# Altium schematic sheet MAIN-SCH.SchDoc
size A; SheetNumber: 1; SheetTotal: 2
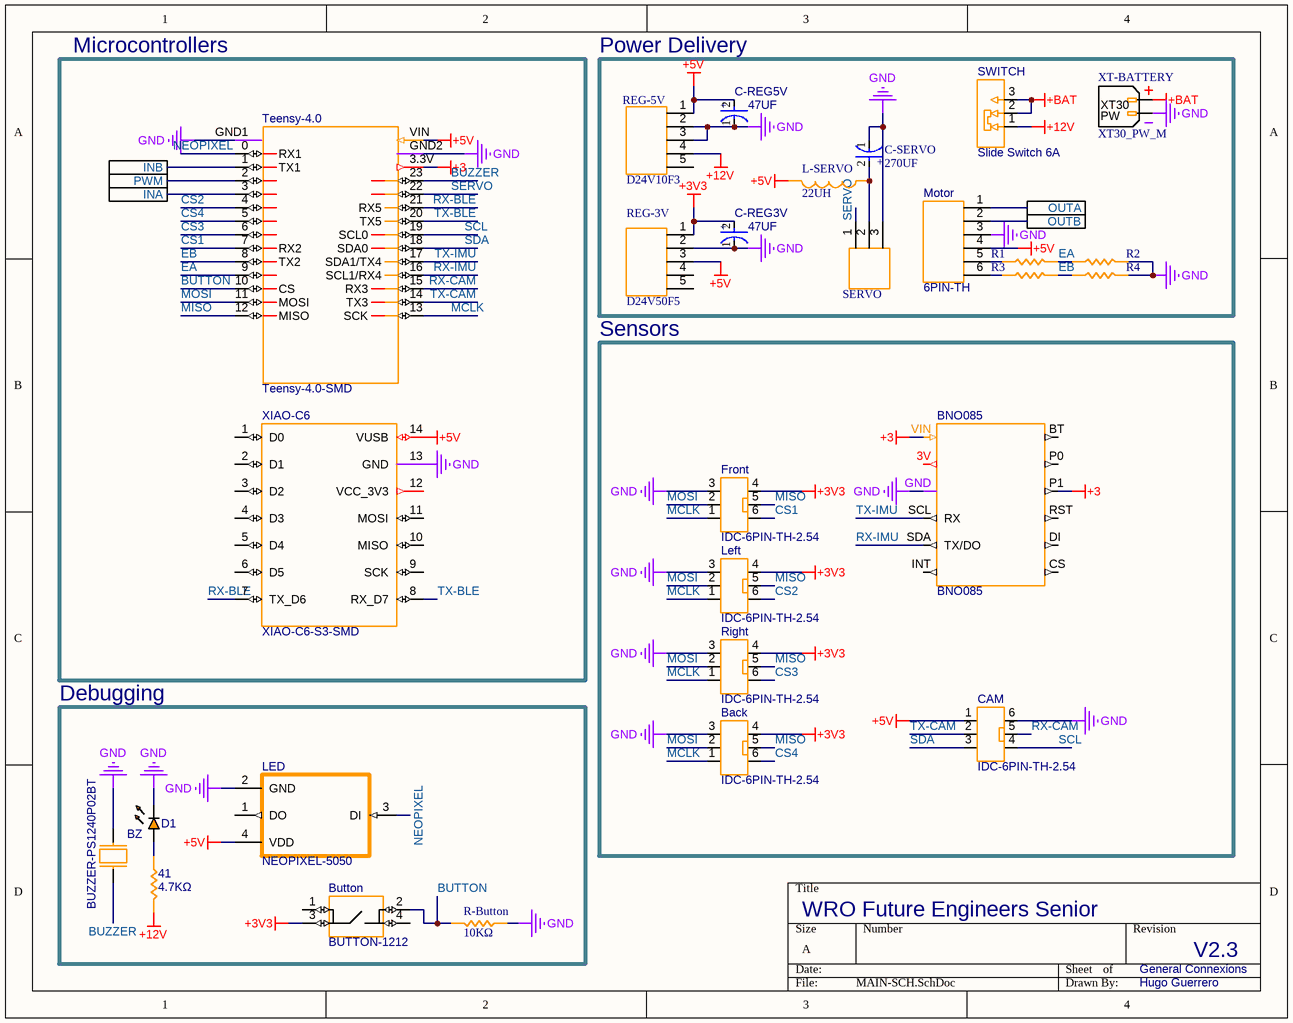
[diagram p0: MAIN-SCH.SchDoc]

## Parts
41  4.7KΩ  [RES_0603]
Back  IDC-6PIN-TH-2.54  [IDC-6PIN-TH-2.54]
BNO085  BNO085  [BNO085]
Button  BUTTON-1212  [BUTTON]
BZ  BUZZER-PS1240P02BT  [BUZZER]
C-REG3V  47UF  [FP-FTD8-MFG]
C-REG5V  47UF  [FP-FTD8-MFG]
C-SERVO  270UF  [FP-FTD8-MFG]
CAM  IDC-6PIN-TH-2.54  [IDC-6PIN-TH-2.54]
D1  LED_0603  [LED_0603]  (value not drawn)
D24V10F3  REG-5V  [5PIN-TH]
D24V50F5  REG-3V  [5PIN-TH]
Front  IDC-6PIN-TH-2.54  [IDC-6PIN-TH-2.54]
L-SERVO  22UH  [WRO-INDUCTOR]
LED  NEOPIXEL-5050  [NEOPIXEL-5050]
Left  IDC-6PIN-TH-2.54  [IDC-6PIN-TH-2.54]
Motor  6PIN-TH  [6PIN-TH]
R1  10KΩ  [RES_0603]  (value not drawn)
R2  10KΩ  [RES_0603]  (value not drawn)
R3  10KΩ  [RES_0603]  (value not drawn)
R4  10KΩ  [RES_0603]  (value not drawn)
R-Button  10KΩ  [RES_0603]
Right  IDC-6PIN-TH-2.54  [IDC-6PIN-TH-2.54]
SERVO  3PIN  [3PIN]  (value not drawn)
SWITCH  Slide Switch 6A  [Slide Switch 6A]
Teensy-4.0  Teensy-4.0-SMD  [Teensy-4.0-SMD]
XIAO-C6  XIAO-C6-S3-SMD  [XIAO-C6-S3-SMD]
XT-BATTERY  XT30_PW_M  [XT30_PW_M]

## Blocks framed on the sheet
Microcontrollers: Teensy-4.0 XIAO-C6
Power Delivery: C-REG3V C-REG5V C-SERVO D24V10F3 D24V50F5 L-SERVO Motor R1-R4 SERVO SWITCH XT-BATTERY
Sensors: Back BNO085 CAM Front Left Right
Debugging: 41 Button BZ D1 LED R-Button

## Ports
INA (see VNH7070-P[1C]), INB (see VNH7070-P[1C]), OUTA (see VNH7070-P[3C]), OUTB (see VNH7070-P[3C]), PWM (see VNH7070-P[1C])

## Nets
+3: BNO085.P1 BNO085.VIN Teensy-4.0.3.3V(3.3V-2)
+3V3: Back.4 Button.3 C-REG3V.2(A) D24V50F5.1 Front.4 Left.4 Right.4
+5V: C-REG5V.2(A) CAM.1 D24V10F3.1 D24V50F5.3 L-SERVO.2 LED.4(VDD) Motor.4 Teensy-4.0.VIN XIAO-C6.14(VUSB)
+12V: 41.1 D24V10F3.4 SWITCH.1(NC)
+BAT: SWITCH.2(COM) SWITCH.3(NO) XT-BATTERY.P
GND: Back.3 BNO085.GND BZ.2 C-REG3V.1(C) C-REG5V.1(C) C-SERVO.1(C) CAM.6 D1.C D24V10F3.2 D24V10F3.3 D24V50F5.2 Front.3 LED.2(GND) Left.3 Motor.3 R2.1 R4.1 R-Button.2 Right.3 SERVO.3 Teensy-4.0.GND1 Teensy-4.0.GND2(GND3) XIAO-C6.13(GND) XT-BATTERY.N
BUTTON: Button.2 R-Button.1 Teensy-4.0.10(CS)
BUZZER: BZ.1 Teensy-4.0.23
CS1: Front.6 Teensy-4.0.7(RX2)
CS2: Left.6 Teensy-4.0.4
CS3: Right.6 Teensy-4.0.6
CS4: Back.6 Teensy-4.0.5
EA: R1.1 R2.2 Teensy-4.0.9
EB: R3.1 R4.2 Teensy-4.0.8(TX2)
INA: Teensy-4.0.3 ; port INA
INB: Teensy-4.0.1(TX1) ; port INB
MCLK: Back.1 Front.1 Left.1 Right.1 Teensy-4.0.13(SCK)
MISO: Back.5 Front.5 Left.5 Right.5 Teensy-4.0.12(MISO)
MOSI: Back.2 Front.2 Left.2 Right.2 Teensy-4.0.11(MOSI)
NEOPIXEL: LED.3(DI) Teensy-4.0.0(RX1)
OUTA: Motor.1 ; port OUTA
OUTB: Motor.2 ; port OUTB
PWM: Teensy-4.0.2 ; port PWM
RX-BLE: Teensy-4.0.21(RX5) XIAO-C6.7(TX_D6)
RX-CAM: CAM.5 Teensy-4.0.15(RX3)
RX-IMU: BNO085.SDA(TX/DO) Teensy-4.0.16(SCL1/RX4)
SCL: CAM.4 Teensy-4.0.19(SCL0)
SDA: CAM.3 Teensy-4.0.18(SDA0)
SERVO: SERVO.1 Teensy-4.0.22
TX-BLE: Teensy-4.0.20(TX5) XIAO-C6.8(RX_D7)
TX-CAM: CAM.2 Teensy-4.0.14(TX3)
TX-IMU: BNO085.SCL(RX) Teensy-4.0.17(SDA1/TX4)
Net41_2: 41.2 D1.A
NetC-SERVO_2: C-SERVO.2(A) L-SERVO.1 SERVO.2
NetMotor_5: Motor.5 R1.2
NetMotor_6: Motor.6 R3.2

Not connected (* = marked no-connect by the designer): BNO085 3V BT CS DI INT P0 RST; Button 1 4; D24V10F3 5(05); D24V50F5 4(04) 5(05); LED 1(DO); XIAO-C6 1(D0) 2(D1) 3(D2) 4(D3) 5(D4) 6(D5) 9(SCK) 10(MISO) 11(MOSI) 12(VCC_3V3)

## Notes on the sheet
- WRO Future Engineers Senior
- General Connexions
- V2.3
- Hugo Guerrero
- (in symbol CMP-05427-000088-1) +
- (in symbol XT30_PW_M) XT30; PW

## Library data of the parts
41 R1-R4 R-Button = RES_0603: Resistor SMD 0603 generic
Button = BUTTON
C-REG3V C-REG5V C-SERVO = CMP-05427-000088-1: CAP ALUM 220UF 20% 25V SMD; Dielectric Material: Aluminium; ESR (Equivalent Series Resistance): 160mR; Ripple Current: 600mA; Life (Hours): 2000Hour; Leakage Current: 55uA; Lead Diameter: 0.65mm; Series: FT; RoHS Compliant: Yes; Case/Package: Radial; Packaging: Tape and Reel; Contact Plating: Tin; Package Quantity: 1; Mount: Surface Mount; Number of Pins: 8; Tolerance: 20%; Height - Seated (Max): 0.315inch; Length: 7.7mm; Lead Free: Lead Free; Voltage: 25V; Construction: Cylindrical; Radiation Hardening: No; Lead Pitch: 1.8mm; REACH SVHC: No SVHC; Capacitance: 220uF; Voltage Rating: 25V; Height: 7.7mm; Diameter: 6.3mm; Max Operating Temperature: 105°C; Termination: SMD/SMT; Min Operating Temperature: -55°C; Voltage Rating (DC): 25V; Ripple Current (AC): 600mA
D24V10F3 D24V50F5 = 5PIN-TH: 2.54 Header
L-SERVO = WRO-INDUCTOR: Voltage Boost Inductor
SERVO = 3PIN: 2.54 Header